# Altium schematic sheet USB & Ethernet.SchDoc
size 219 x 209 mm
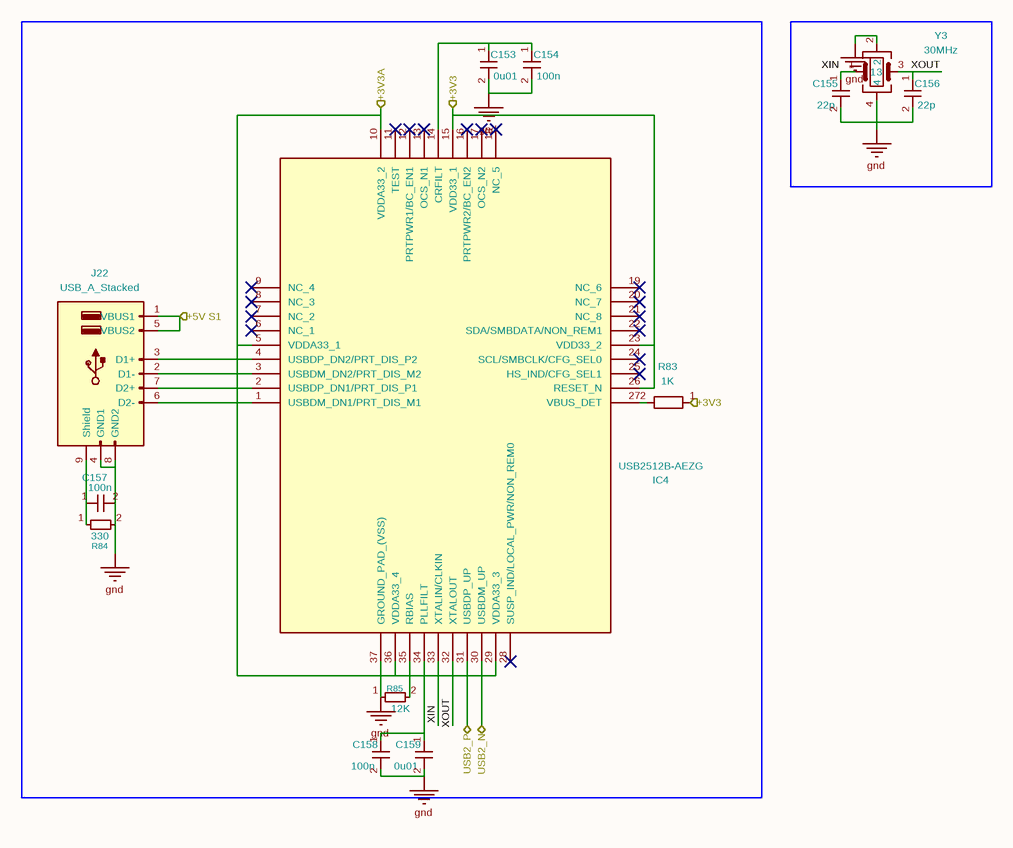
[diagram p0: USB & Ethernet.SchDoc]

## Parts
C153  0u01  [C_0402_1005Metric]
C154  100n  [C_0603_1608Metric]
C155  22p  [C_0402_1005Metric]
C156  22p  [C_0402_1005Metric]
C157  100n  [C_0603_1608Metric]
C158  100n  [C_0603_1608Metric]
C159  0u01  [C_0402_1005Metric]
IC4  USB2512B-AEZG  [QFN50P600X600X100-37N-D]
J22  USB_A_Stacked  [USB_A_Wuerth_61400826021_Horizontal_Stacked]
R83  1K  [R_0603_1608Metric]
R84  330  [R_0603_1608Metric]
R85  12K  [R_0603_1608Metric]
Y3  30MHz  [ABM810000MHZ12D2W]

## Ports
+3V3 (in), +3V3A (in), +5V S1 (in), USB2_N (bidir), USB2_P (bidir)

## Nets
gnd: C153.2 C154.2 C155.2 C156.2 C157.2 C158.2 C159.2 IC4.37(GROUND_PAD_(VSS)) J22.4(GND1) J22.8(GND2) R84.2 R85.1 Y3.2 Y3.4
+3V3: IC4.15(VDD33_1) IC4.23(VDD33_2) IC4.26(RESET_N) R83.1 ; port +3V3
+3V3A: IC4.5(VDDA33_1) IC4.10(VDDA33_2) IC4.29(VDDA33_3) IC4.36(VDDA33_4) ; port +3V3A
+5V S1: J22.1(VBUS1) J22.5(VBUS2) ; port +5V S1
USB2_N: IC4.30(USBDM_UP) ; port USB2_N
USB2_P: IC4.31(USBDP_UP) ; port USB2_P
XIN: C155.1 IC4.33(XTALIN/CLKIN) Y3.1
XOUT: C156.1 IC4.32(XTALOUT) Y3.3
NetC153_1: C153.1 C154.1 IC4.14(CRFILT)
NetC157_1: C157.1 J22.9(Shield) R84.1
NetC158_1: C158.1 C159.1 IC4.34(PLLFILT)
NetIC4_1: IC4.1(USBDM_DN1/PRT_DIS_M1) J22.6(D2-)
NetIC4_2: IC4.2(USBDP_DN1/PRT_DIS_P1) J22.7(D2+)
NetIC4_3: IC4.3(USBDM_DN2/PRT_DIS_M2) J22.2(D1-)
NetIC4_4: IC4.4(USBDP_DN2/PRT_DIS_P2) J22.3(D1+)
NetIC4_27: IC4.27(VBUS_DET) R83.2
NetIC4_35: IC4.35(RBIAS) R85.2

Not connected (* = marked no-connect by the designer): IC4 6(NC_1)* 7(NC_2)* 8(NC_3)* 9(NC_4)* 11(TEST)* 12(PRTPWR1/BC_EN1)* 13(OCS_N1)* 16(PRTPWR2/BC_EN2)* 17(OCS_N2)* 18(NC_5)* 19(NC_6)* 20(NC_7)* 21(NC_8)* 22(SDA/SMBDATA/NON_REM1)* 24(SCL/SMBCLK/CFG_SEL0)* 25(HS_IND/CFG_SEL1)* 28(SUSP_IND/LOCAL_PWR/NON_REM0)*

## Notes on the sheet
- 1
- 2
- 3
- 4
- A
- B
- C
- D
- Title:
- File: USB & Ethernet.kicad_sch
- Sheet: /
- KiCad E.D.A.  kicad (5.1.4)-1
- Size: User
- Date:
- Rev:
- Id: 1/1

## Library data of the parts
C153-C159 = C_Small: Description: Unpolarized capacitor, small symbol
  C153 C159: Value: 0u01; Footprint: Capacitor_SMD:C_0402_1005Metric
  C154 C157 C158: Value: 100n; Footprint: Capacitor_SMD:C_0603_1608Metric
  C155 C156: Value: 22p; Footprint: Capacitor_SMD:C_0402_1005Metric
IC4 = USB2512B-AEZG: Manufacturer_Name: Microchip; Description: USB 2.0 Hub Controller 2-Port BC QFN36 Microchip USB2512B-AEZG, USB Controller, 480MBps, USB 2.0, 3.3 V, 36-Pin QFN; Height: 1; Manufacturer_Part_Number: USB2512B-AEZG; Mouser Part Number: 886-USB2512B-AEZG; Mouser Price/Stock: https://www.mouser.co.uk/ProductDetail/Microchip-Technology/USB2512B-AEZG?qs=pA5MXup5wxGNvJiLqKVEsA%3D%3D; Arrow Part Number: USB2512B-AEZG; Arrow Price/Stock: https://www.arrow.com/en/products/usb2512b-aezg/microchip-technology?region=nac; Value: USB2512B-AEZG; Footprint: USB2512B-AEZG:QFN50P600X600X100-37N-D
J22 = USB_A_Stacked: Description: USB Type A connector, stacked; Value: USB_A_Stacked; Footprint: Connector_USB:USB_A_Wuerth_61400826021_Horizontal_Stacked
R83 = R: Description: Resistor; Value: 1K; Footprint: Resistor_SMD:R_0603_1608Metric
R84 R85 = R_Small: Description: Resistor, small symbol; Footprint: Resistor_SMD:R_0603_1608Metric
  R84: Value: 330
  R85: Value: 12K
Y3 = Crystal_GND24: Description: Four pin crystal, GND on pins 2 and 4; Value: 30MHz; Footprint: ABM8-30.000MHZ-B2-T:ABM810000MHZ12D2W